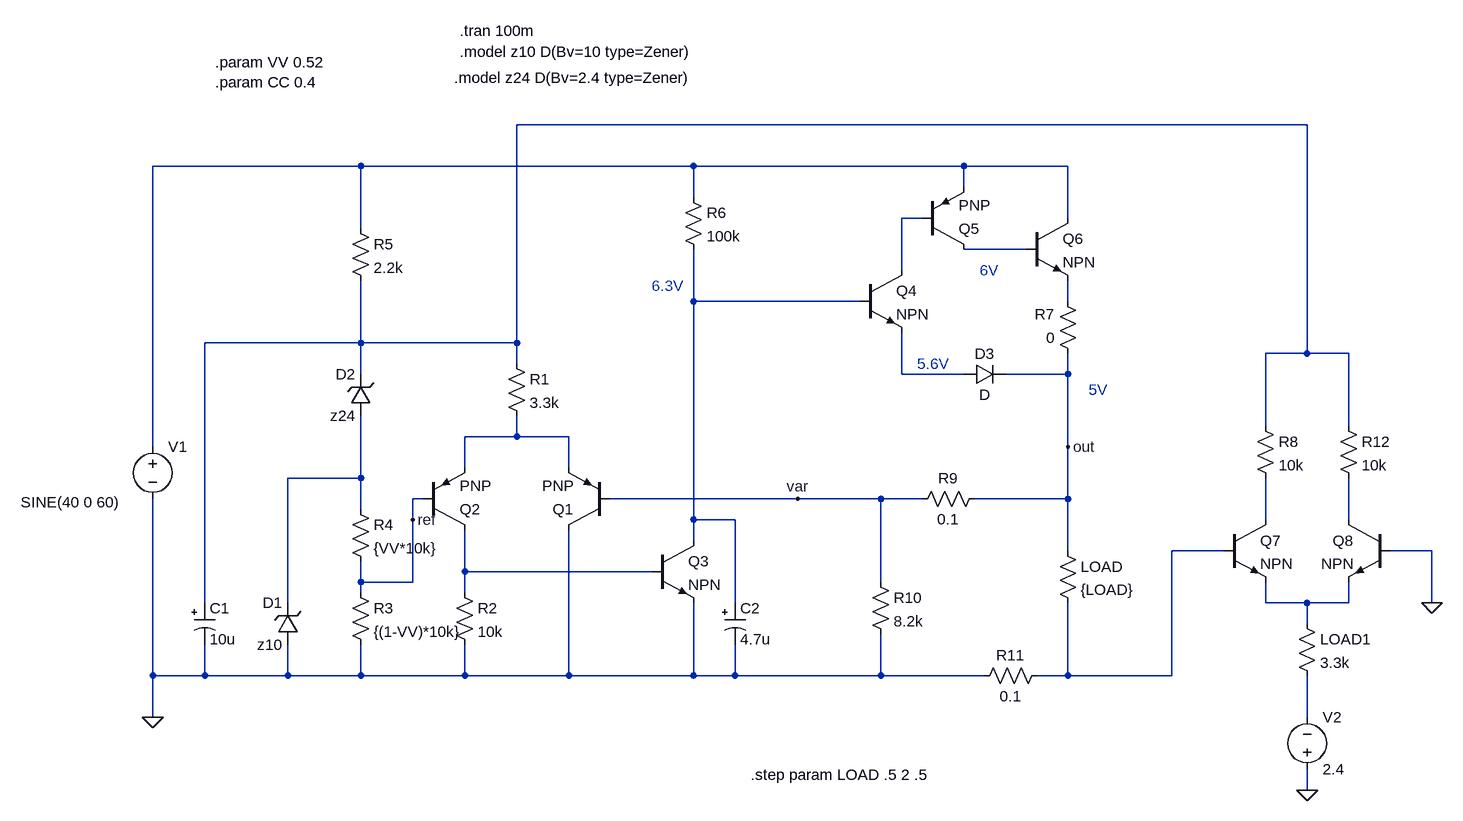
[diagram p0: schematic Draft18.asc]
Draft18.asc, the LTspice schematic file:
Version 4
SHEET 1 1712 832
WIRE 1504 -208 288 -208
WIRE 48 -144 -272 -144
WIRE 560 -144 48 -144
WIRE 976 -144 560 -144
WIRE 1136 -144 976 -144
WIRE 976 -112 976 -144
WIRE 560 -96 560 -144
WIRE 912 -64 880 -64
WIRE 1136 -64 1136 -144
WIRE 48 -48 48 -144
WIRE 1072 -16 976 -16
WIRE 880 16 880 -64
WIRE 560 64 560 -16
WIRE 816 64 560 64
WIRE 1136 64 1136 32
WIRE 48 128 48 32
WIRE 48 128 -192 128
WIRE 288 128 288 -208
WIRE 288 128 48 128
WIRE 1504 144 1504 -208
WIRE 1504 144 1440 144
WIRE 1568 144 1504 144
WIRE 288 160 288 128
WIRE 48 176 48 128
WIRE 880 176 880 112
WIRE 976 176 880 176
WIRE 1136 176 1136 144
WIRE 1136 176 1040 176
WIRE 1440 256 1440 144
WIRE 1568 256 1568 144
WIRE 288 272 288 240
WIRE 288 272 208 272
WIRE 368 272 288 272
WIRE -272 288 -272 -144
WIRE 1136 288 1136 176
WIRE 208 320 208 272
WIRE 368 320 368 272
WIRE 48 336 48 240
WIRE 48 336 -64 336
WIRE 144 368 128 368
WIRE 720 368 432 368
WIRE 848 368 720 368
WIRE 912 368 848 368
WIRE 1136 368 1136 288
WIRE 1136 368 992 368
WIRE 48 384 48 336
WIRE 128 400 128 368
WIRE 560 400 560 64
WIRE 624 400 560 400
WIRE 1440 400 1440 336
WIRE 1568 400 1568 336
WIRE 560 432 560 400
WIRE 1136 448 1136 368
WIRE 1376 448 1296 448
WIRE 1696 448 1632 448
WIRE 208 480 208 416
WIRE 496 480 208 480
WIRE 48 496 48 464
WIRE 128 496 128 400
WIRE 128 496 48 496
WIRE 848 496 848 368
WIRE 48 512 48 496
WIRE 208 512 208 480
WIRE -192 528 -192 128
WIRE -64 528 -64 336
WIRE 624 528 624 400
WIRE 1440 528 1440 496
WIRE 1504 528 1440 528
WIRE 1568 528 1568 496
WIRE 1568 528 1504 528
WIRE 1696 528 1696 448
WIRE 1504 560 1504 528
WIRE -272 640 -272 368
WIRE -192 640 -192 592
WIRE -192 640 -272 640
WIRE -64 640 -64 592
WIRE -64 640 -192 640
WIRE 48 640 48 592
WIRE 48 640 -64 640
WIRE 208 640 208 592
WIRE 208 640 48 640
WIRE 368 640 368 416
WIRE 368 640 208 640
WIRE 560 640 560 528
WIRE 560 640 368 640
WIRE 624 640 624 592
WIRE 624 640 560 640
WIRE 848 640 848 576
WIRE 848 640 624 640
WIRE 1008 640 848 640
WIRE 1136 640 1136 528
WIRE 1136 640 1088 640
WIRE 1296 640 1296 448
WIRE 1296 640 1136 640
WIRE -272 704 -272 640
WIRE 1504 704 1504 640
WIRE 1504 816 1504 784
FLAG -272 704 0
FLAG 1136 288 out
FLAG 720 368 var
FLAG 128 400 ref
FLAG 1696 528 0
FLAG 1504 816 0
SYMBOL pnp 432 416 R180
SYMATTR InstName Q1
SYMBOL pnp 144 416 M180
SYMATTR InstName Q2
SYMBOL res 272 144 R0
SYMATTR InstName R1
SYMATTR Value 3.3k
SYMBOL res 192 496 R0
SYMATTR InstName R2
SYMATTR Value 10k
SYMBOL res 32 496 R0
SYMATTR InstName R3
SYMATTR Value {(1-VV)*10k}
SYMBOL res 32 368 R0
SYMATTR InstName R4
SYMATTR Value {VV*10k}
SYMBOL res 32 -64 R0
SYMATTR InstName R5
SYMATTR Value 2.2k
SYMBOL zener -48 592 R180
WINDOW 0 24 64 Left 2
WINDOW 3 24 0 Left 2
SYMATTR InstName D1
SYMATTR Value z10
SYMBOL zener 64 240 R180
WINDOW 0 24 64 Left 2
WINDOW 3 24 0 Left 2
SYMATTR InstName D2
SYMATTR Value z24
SYMBOL voltage -272 272 R0
WINDOW 3 -203 101 Left 2
SYMATTR InstName V1
SYMATTR Value SINE(40 0 60)
SYMBOL polcap -208 528 R0
SYMATTR InstName C1
SYMATTR Value 10u
SYMBOL npn 496 432 R0
SYMATTR InstName Q3
SYMBOL res 544 -112 R0
SYMATTR InstName R6
SYMATTR Value 100k
SYMBOL npn 816 16 R0
SYMATTR InstName Q4
SYMBOL pnp 912 -16 M180
SYMATTR InstName Q5
SYMBOL npn 1072 -64 R0
SYMATTR InstName Q6
SYMBOL diode 976 192 R270
WINDOW 0 32 32 VTop 2
WINDOW 3 0 32 VBottom 2
SYMATTR InstName D3
SYMBOL res 1120 432 R0
SYMATTR InstName LOAD
SYMATTR Value {LOAD}
SYMBOL res 1104 624 R90
WINDOW 0 0 56 VBottom 2
WINDOW 3 32 56 VTop 2
SYMATTR InstName R11
SYMATTR Value 0.1
SYMBOL res 1008 352 R90
WINDOW 0 0 56 VBottom 2
WINDOW 3 32 56 VTop 2
SYMATTR InstName R9
SYMATTR Value 0.1
SYMBOL res 832 480 R0
SYMATTR InstName R10
SYMATTR Value 8.2k
SYMBOL polcap 608 528 R0
SYMATTR InstName C2
SYMATTR Value 4.7u
SYMBOL res 1152 160 R180
WINDOW 0 36 76 Left 2
WINDOW 3 36 40 Left 2
SYMATTR InstName R7
SYMATTR Value 0
SYMBOL npn 1376 400 R0
SYMATTR InstName Q7
SYMBOL npn 1632 400 M0
SYMATTR InstName Q8
SYMBOL res 1488 544 R0
SYMATTR InstName LOAD1
SYMATTR Value 3.3k
SYMBOL res 1424 240 R0
SYMATTR InstName R8
SYMATTR Value 10k
SYMBOL res 1552 240 R0
SYMATTR InstName R12
SYMATTR Value 10k
SYMBOL voltage 1504 800 M180
WINDOW 0 24 96 Left 2
WINDOW 3 24 16 Left 2
SYMATTR InstName V2
SYMATTR Value 2.4
TEXT 192 -280 Left 2 !.model z24 D(Bv=2.4 type=Zener)
TEXT 200 -352 Left 2 !.tran 100m
TEXT 200 -320 Left 2 !.model z10 D(Bv=10 type=Zener)
TEXT 1168 200 Left 2 ;5V
TEXT 904 160 Left 2 ;5.6V
TEXT 496 40 Left 2 ;6.3V
TEXT 1000 16 Left 2 ;6V
TEXT -176 -304 Left 2 !.param VV 0.52\n.param CC 0.4
TEXT 648 792 Left 2 !.step param LOAD .5 2 .5

The netlist it stands for:
* Draft18.asc
Q1 0 var N008 0 PNP
Q2 N013 ref N008 0 PNP
R1 N001 N008 3.3k
R2 N013 0 10k
R3 ref 0 {(1-VV)*10k}
R4 N009 ref {VV*10k}
R5 N002 N001 2.2k
D1 0 N009 z10
D2 N009 N001 z24
V1 N002 0 SINE(40 0 60)
C1 N001 0 10u
Q3 N005 N013 0 0 NPN
R6 N002 N005 100k
Q4 N003 N005 N007 0 NPN
Q5 N004 N003 N002 0 PNP
Q6 N002 N004 N006 0 NPN
D3 N007 out D
R§LOAD out N012 {LOAD}
R11 N012 0 0.1
R9 out var 0.1
R10 var 0 8.2k
C2 N005 0 4.7u
R7 out N006 0
Q7 N010 N012 N014 0 NPN
Q8 N011 0 N014 0 NPN
R§LOAD1 N014 N015 3.3k
R8 N001 N010 10k
R12 N001 N011 10k
V2 0 N015 2.4
.model D D
.lib standard.dio
.model NPN NPN
.model PNP PNP
.lib standard.bjt
.model z24 D(Bv=2.4 type=Zener)
.tran 100m
.model z10 D(Bv=10 type=Zener)
* 5V
* 5.6V
* 6.3V
* 6V
.param VV 0.52
.param CC 0.4
.step param LOAD .5 2 .5
.backanno
.end